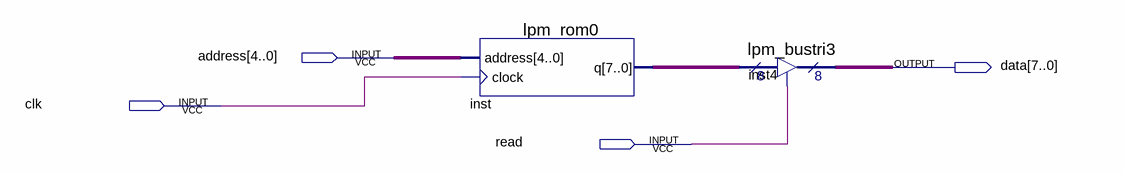
[diagram p0: schematic sheet]
// Quartus schematic rom.bdf as structural Verilog: 2 symbols, 4 pins
module rom (
  input  [4:0] address,
  input  clk,
  input  read,
  output [7:0] data
);

  wire [7:0] inst_q;

  lpm_rom0 inst (.address(address), .clock(clk), .q(inst_q));
  lpm_bustri3 inst4 (.enabledt(read), .data(inst_q), .tridata(data));
endmodule
